# EAGLE design MBPH_MF_NGv1.2.2 (EAGLE 6.5.0)

## Sheet 1 of 2
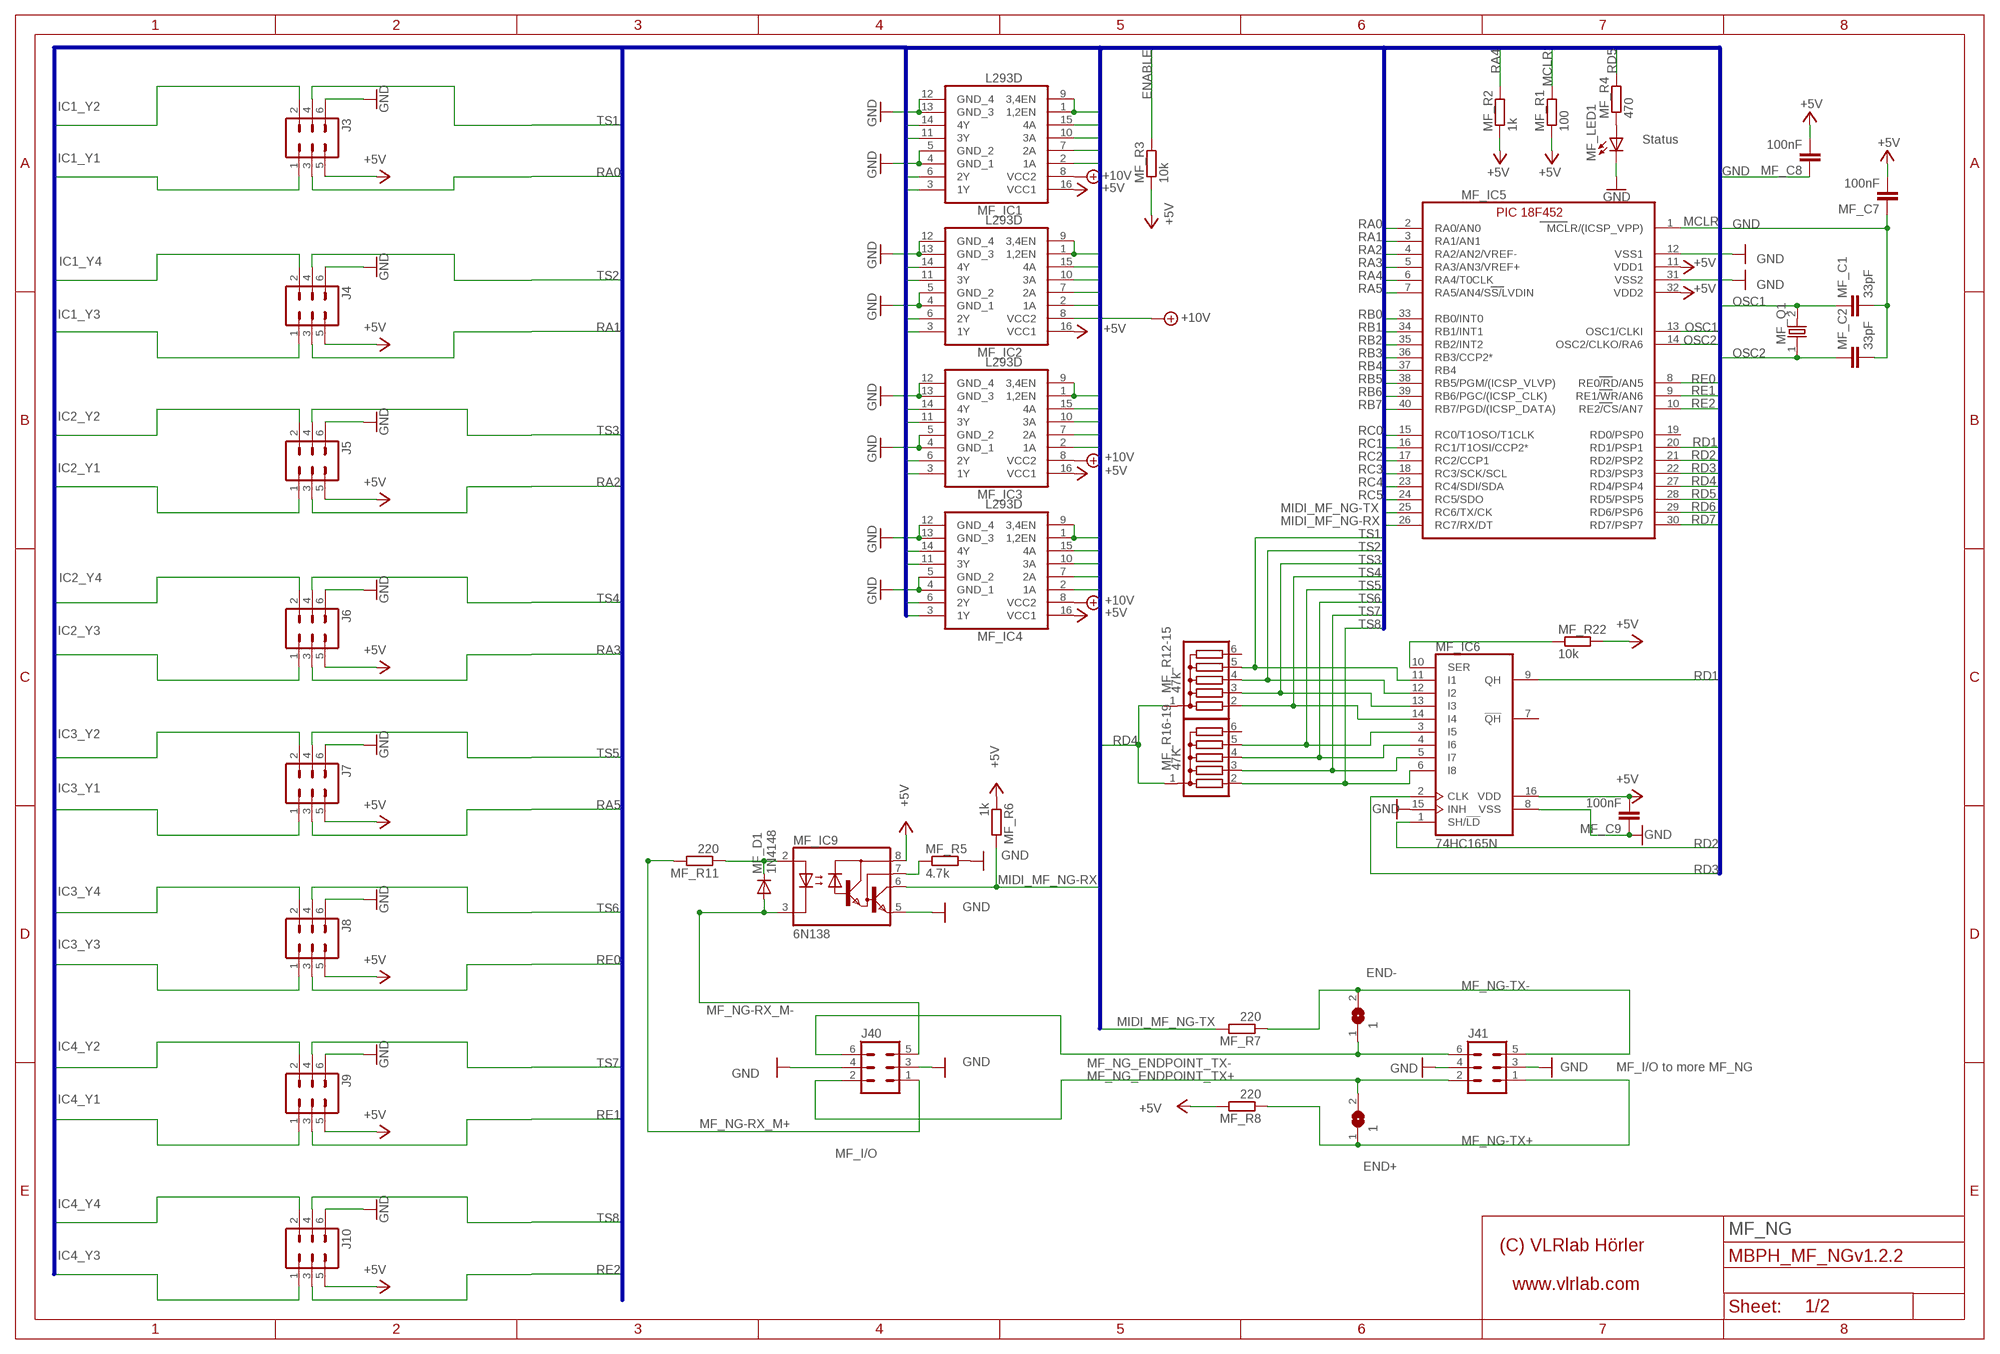
[diagram p0: schematic, sheet 1]

### Parts
END+  1  SJ  [SJ]
END-  1  SJ  [SJ]
J3  ML6  [ML6]
J4  ML6  [ML6]
J5  ML6  [ML6]
J6  ML6  [ML6]
J7  ML6  [ML6]
J8  ML6  [ML6]
J9  ML6  [ML6]
J10  ML6  [ML6]
J40  MF_I/O  ML6  [ML6]
J41  MF_I/O to more MF_NG  ML6  [ML6]
MF_C1  33pF  C-EU025-030X050  [C025-030X050]
MF_C2  33pF  C-EU025-030X050  [C025-030X050]
MF_C7  100nF  C5/3  [C5B3]
MF_C8  100nF  C5/3  [C5B3]
MF_C9  100nF  C5/3  [C5B3]
MF_D1  1N4148  1N4148DO35-7  [DO35-7]
MF_IC1  L293D  [DIL16]
MF_IC2  L293D  [DIL16]
MF_IC3  L293D  [DIL16]
MF_IC4  L293D  [DIL16]
MF_IC5  PIC18F452  PIC18F4X2DIL40  [DIL40]
MF_IC6  74HC165N  [DIL16]
MF_IC9  6N138  [DIL08]
MF_LED1  Status  LED3MM  [LED3MM]
MF_Q1  ECS-100-20-4X-DU  [HC-49/USX]
MF_R1  100  R-EU_0204/7  [0204/7]
MF_R2  1k  R-EU_0204/7  [0204/7]
MF_R3  10k  R-EU_0204/7  [0204/7]
MF_R4  470  R-EU_0204/7  [0204/7]
MF_R5  4.7k  R-EU_0204/7  [0204/7]
MF_R6  1k  R-EU_0204/7  [0204/7]
MF_R7  220  R-EU_0204/7  [0204/7]
MF_R8  220  R-EU_0204/7  [0204/7]
MF_R11  220  R-EU_0204/7  [0204/7]
MF_R12-15  47k  4306R  [SIL6]
MF_R16-19  47K  4306R  [SIL6]
MF_R22  10k  R-EU_0204/7  [0204/7]

### Nets
+5V [VDD]: J3.5 J4.5 J5.5 J6.5 J7.5 J8.5 J9.5 J10.5 MF_C7.2 MF_C8.2 MF_C9.2 MF_IC1.16(VCC1) MF_IC2.16(VCC1) MF_IC3.16(VCC1) MF_IC4.16(VCC1) MF_IC5.11(VDD1) MF_IC5.32(VDD2) MF_IC6.16(VDD) MF_IC9.8(VCC) MF_R1.1 MF_R2.1 MF_R3.1 MF_R6.1 MF_R8.2 MF_R22.2 ; also sheet 2
+10V [10V]: MF_IC1.8(VCC2) MF_IC2.8(VCC2) MF_IC3.8(VCC2) MF_IC4.8(VCC2) ; also sheet 2
ENABLE: MF_IC1.1(1,2EN) MF_IC1.9(3,4EN) MF_IC2.1(1,2EN) MF_IC2.9(3,4EN) MF_IC3.1(1,2EN) MF_IC3.9(3,4EN) MF_IC4.1(1,2EN) MF_IC4.9(3,4EN) MF_R3.2
GND: J3.6 J4.6 J5.6 J6.6 J7.6 J8.6 J9.6 J10.6 J40.3 J40.4 J41.3 J41.4 MF_C1.2 MF_C2.2 MF_C7.1 MF_C8.1 MF_C9.1 MF_IC1.4(GND_1) MF_IC1.5(GND_2) MF_IC1.12(GND_4) MF_IC1.13(GND_3) MF_IC2.4(GND_1) MF_IC2.5(GND_2) MF_IC2.12(GND_4) MF_IC2.13(GND_3) MF_IC3.4(GND_1) MF_IC3.5(GND_2) MF_IC3.12(GND_4) MF_IC3.13(GND_3) MF_IC4.4(GND_1) MF_IC4.5(GND_2) MF_IC4.12(GND_4) MF_IC4.13(GND_3) MF_IC5.12(VSS1) MF_IC5.31(VSS2) MF_IC6.8(VSS) MF_IC6.15(INH) MF_IC9.5(GND) MF_LED1.K(C) MF_R5.2 ; also sheet 2
IC1_Y1 [10V]: J3.1 MF_IC1.3(1Y)
IC1_Y2 [10V]: J3.2 MF_IC1.6(2Y)
IC1_Y3 [10V]: J4.1 MF_IC1.11(3Y)
IC1_Y4 [10V]: J4.2 MF_IC1.14(4Y)
IC2_Y1 [10V]: J5.1 MF_IC2.3(1Y)
IC2_Y2 [10V]: J5.2 MF_IC2.6(2Y)
IC2_Y3 [10V]: J6.1 MF_IC2.11(3Y)
IC2_Y4 [10V]: J6.2 MF_IC2.14(4Y)
IC3_Y1 [10V]: J7.1 MF_IC3.3(1Y)
IC3_Y2 [10V]: J7.2 MF_IC3.6(2Y)
IC3_Y3 [10V]: J8.1 MF_IC3.11(3Y)
IC3_Y4 [10V]: J8.2 MF_IC3.14(4Y)
IC4_Y1 [10V]: J9.1 MF_IC4.3(1Y)
IC4_Y2 [10V]: J9.2 MF_IC4.6(2Y)
IC4_Y3 [10V]: J10.1 MF_IC4.11(3Y)
IC4_Y4 [10V]: J10.2 MF_IC4.14(4Y)
MCLR: MF_IC5.1(MCLR/(ICSP_VPP)) MF_R1.2
MF_NG-RX_M+: J40.1 MF_R11.2
MF_NG-RX_M-: J40.5 MF_D1.A MF_IC9.3(C)
MF_NG-TX+: END+.1 J41.1 MF_R8.1
MF_NG-TX-: END-.2 J41.5 MF_R7.1
MF_NG_ENDPOINT_TX+: END+.2 J40.2 J41.2
MF_NG_ENDPOINT_TX-: END-.1 J40.6 J41.6
MIDI_MF_NG-RX: MF_IC5.26(RC7/RX/DT) MF_IC9.6(VO) MF_R6.2
MIDI_MF_NG-TX: MF_IC5.25(RC6/TX/CK) MF_R7.2
N$1: MF_IC6.10(SER) MF_R22.1
N$2: MF_LED1.A MF_R4.1
N$76: MF_IC9.7(VB) MF_R5.1
N$101: MF_D1.C MF_IC9.2(A) MF_R11.1
OSC1: MF_C1.1 MF_IC5.13(OSC1/CLKI) MF_Q1.2
OSC2: MF_C2.1 MF_IC5.14(OSC2/CLKO/RA6) MF_Q1.1
RA0: J3.3 MF_IC5.2(RA0/AN0)
RA1: J4.3 MF_IC5.3(RA1/AN1)
RA2: J5.3 MF_IC5.4(RA2/AN2/VREF-)
RA3: J6.3 MF_IC5.5(RA3/AN3/VREF+)
RA4: MF_IC5.6(RA4/T0CLK) MF_R2.2
RA5: J7.3 MF_IC5.7(RA5/AN4/SS/LVDIN)
RB0: MF_IC2.15(4A) MF_IC5.33(RB0/INT0)
RB1: MF_IC2.10(3A) MF_IC5.34(RB1/INT1)
RB2: MF_IC2.7(2A) MF_IC5.35(RB2/INT2)
RB3: MF_IC2.2(1A) MF_IC5.36(RB3/CCP2*)
RB4: MF_IC1.15(4A) MF_IC5.37(RB4)
RB5: MF_IC1.10(3A) MF_IC5.38(RB5/PGM/(ICSP_VLVP))
RB6: MF_IC1.7(2A) MF_IC5.39(RB6/PGC/(ICSP_CLK))
RB7: MF_IC1.2(1A) MF_IC5.40(RB7/PGD/(ICSP_DATA))
RC0: MF_IC4.15(4A) MF_IC5.15(RC0/T1OSO/T1CLK)
RC1: MF_IC4.10(3A) MF_IC5.16(RC1/T1OSI/CCP2*)
RC2: MF_IC4.7(2A) MF_IC5.17(RC2/CCP1)
RC3: MF_IC4.2(1A) MF_IC5.18(RC3/SCK/SCL)
RC4: MF_IC3.15(4A) MF_IC5.23(RC4/SDI/SDA)
RC5: MF_IC3.10(3A) MF_IC5.24(RC5/SDO)
RD1: MF_IC5.20(RD1/PSP1) MF_IC6.9(QH)
RD2: MF_IC5.21(RD2/PSP2) MF_IC6.1(SH/!LD)
RD3: MF_IC5.22(RD3/PSP3) MF_IC6.2(CLK)
RD4: MF_IC5.27(RD4/PSP4) MF_R12-15.1 MF_R16-19.1
RD5: MF_IC5.28(RD5/PSP5) MF_R4.2
RD6: MF_IC3.7(2A) MF_IC5.29(RD6/PSP6)
RD7: MF_IC3.2(1A) MF_IC5.30(RD7/PSP7)
RE0: J8.3 MF_IC5.8(RE0/RD/AN5)
RE1: J9.3 MF_IC5.9(RE1/WR/AN6)
RE2: J10.3 MF_IC5.10(RE2/CS/AN7)
TS1: J3.4 MF_IC6.11(I1) MF_R12-15.5
TS2: J4.4 MF_IC6.12(I2) MF_R12-15.4
TS3: J5.4 MF_IC6.13(I3) MF_R12-15.3
TS4: J6.4 MF_IC6.14(I4) MF_R12-15.2
TS5: J7.4 MF_IC6.3(I5) MF_R16-19.5
TS6: J8.4 MF_IC6.4(I6) MF_R16-19.4
TS7: J9.4 MF_IC6.5(I7) MF_R16-19.3
TS8: J10.4 MF_IC6.6(I8) MF_R16-19.2
Unconnected: MF_IC5.19(RD0/PSP0) MF_IC6.7(!QH) MF_R12-15.6 MF_R16-19.6

### Buses
ENABLE,IC1_Y[1..4],IC2_Y[1..4],IC3_Y[1..4],IC4_Y[1..4],MCLR,RA0,RA1,RA2,RA3,RA4,RA5,RE0,RE1,RE2,VDD_5V,VDD_M,GND,OSC1,OSC2,RC0,RC1,RC2,RC3,RD0,RD1,RD2,RD3,RC4,RC5,TX,RX,RD4,RD5,RD6,RD7,RB0,RB1,RB2,RB3,RB4,RB5,RB6,RB7,TS1,TS2,TS3,TS4,TS5,TS6,TS7,TS8,MIDI_MF_NG-TX,MIDI_MF_NG-RX

### Notes on the sheet
- MF_NG

## Sheet 2 of 2
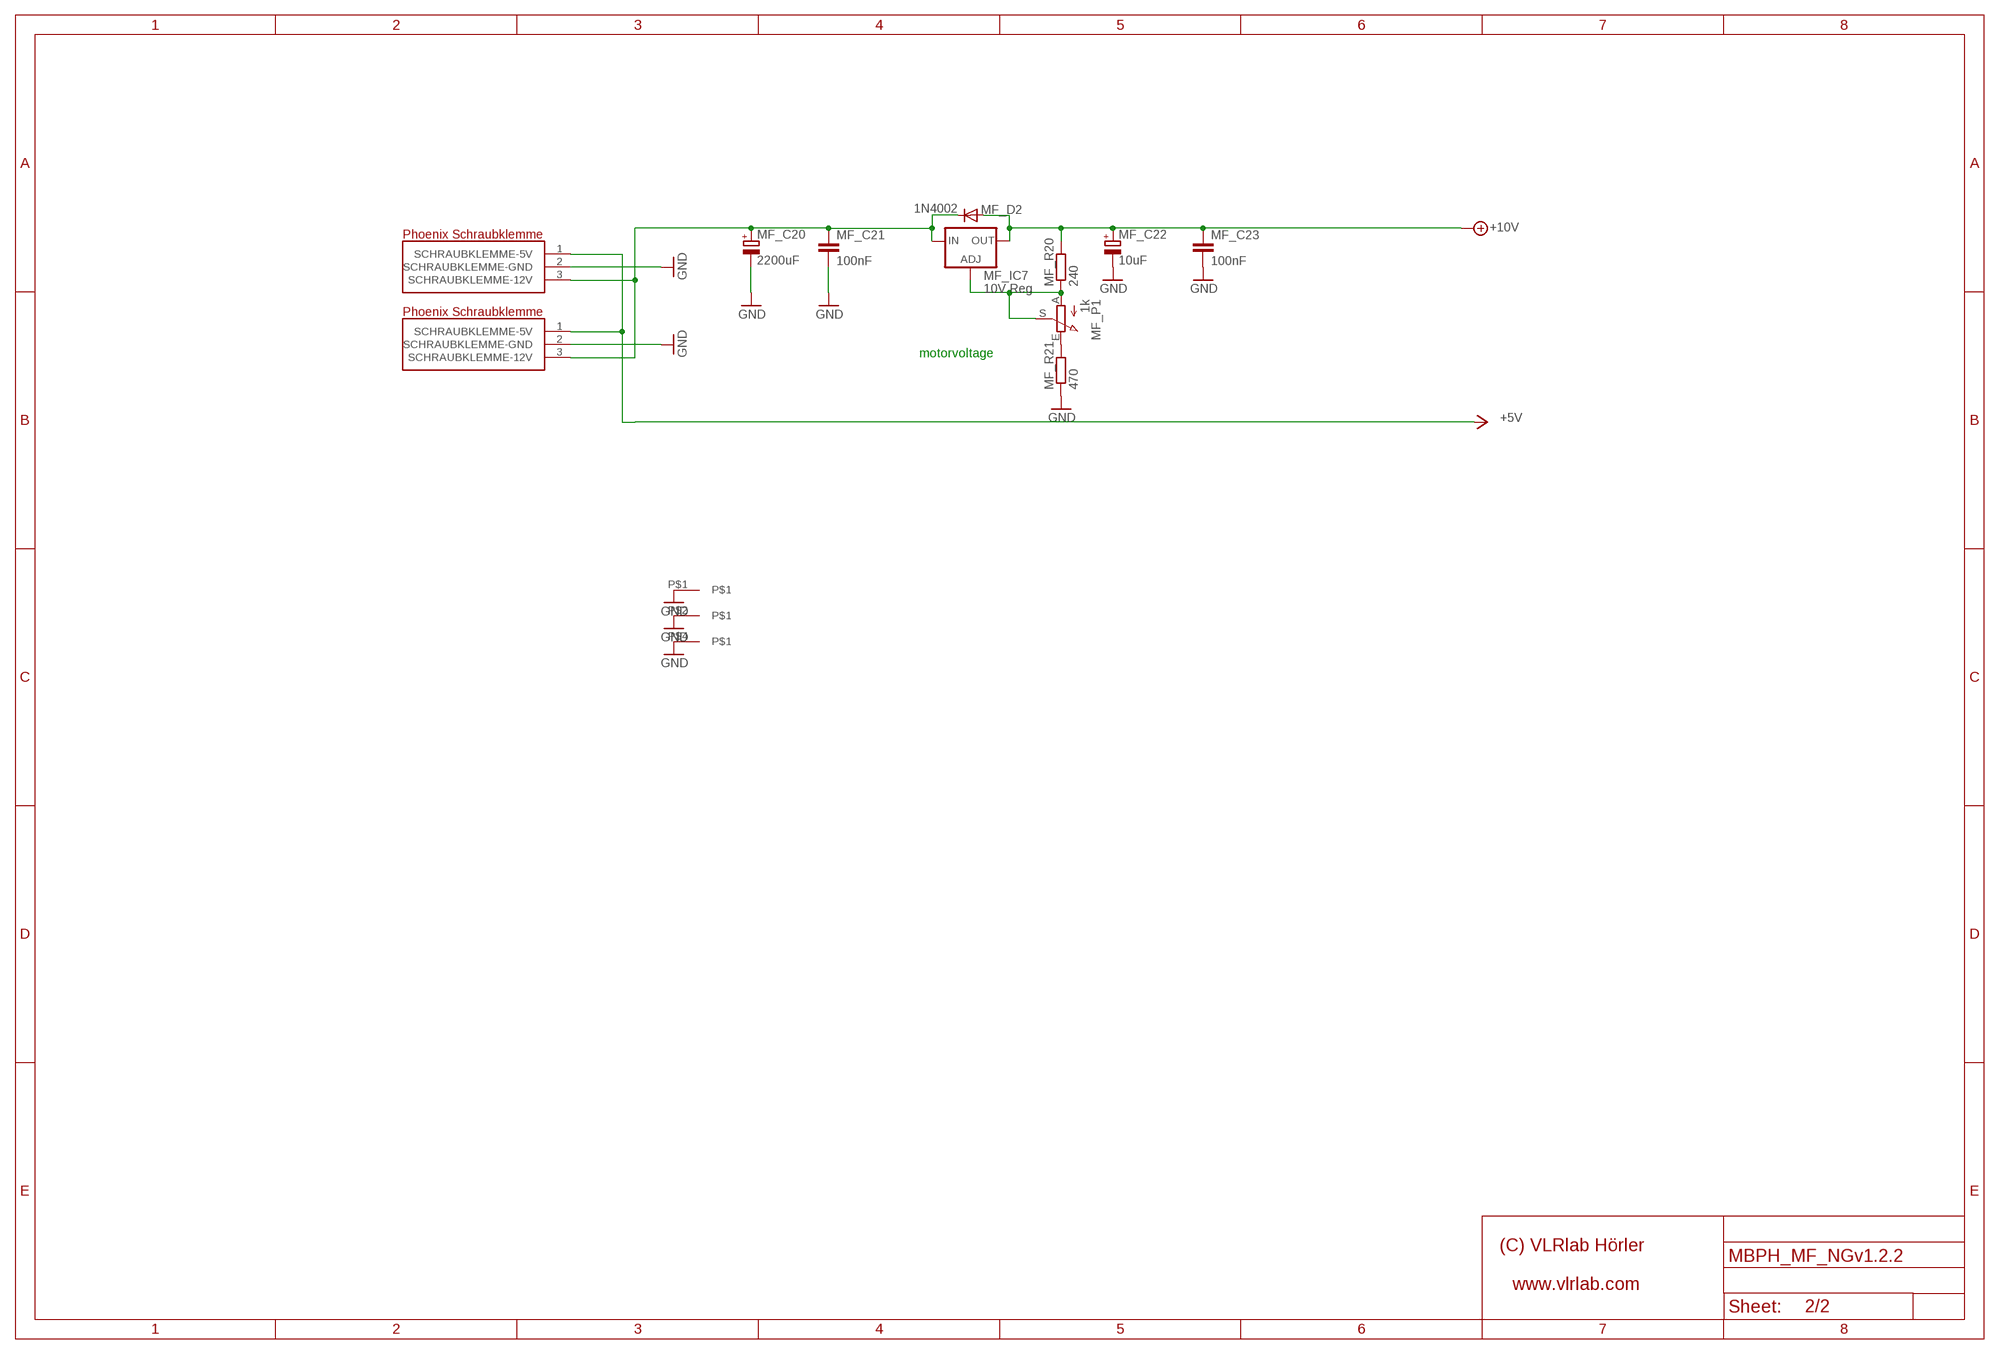
[diagram p1: schematic, sheet 2]

### Parts
KLEMME1  PT-1.5/3  [PT-1.5/3-5.0]
KLEMME2  PT-1.5/3  [PT-1.5/3-5.0]
MF_C20  2200uF  CPOL-EUE5-13  [E5-13]
MF_C21  100nF  C5/3  [C5B3]
MF_C22  10uF  CPOL-EUE2,5-6E  [E2,5-6E]
MF_C23  100nF  C5/3  [C5B3]
MF_D2  1N4002  [D040-10]
MF_IC7  10V Reg  LM317TS  [317TS]
MF_P1  1k  PHIER_6MM  [6MM_V]
MF_R20  240  R-EU_0204/7  [0204/7]
MF_R21  470  R-EU_0204/7  [0204/7]
U$3  MIDIBOX_HALF  [MIDIBOX14X6]

### Nets
+5V [VDD]: KLEMME1.1(SCHRAUBKLEMME-5V) KLEMME2.1(SCHRAUBKLEMME-5V) ; also sheet 1
+10V [10V]: MF_C22.+ MF_C23.1 MF_D2.A MF_IC7.2(OUT) MF_R20.2 ; also sheet 1
+12V [10V]: KLEMME1.3(SCHRAUBKLEMME-12V) KLEMME2.3(SCHRAUBKLEMME-12V) MF_C20.+ MF_C21.1 MF_D2.C MF_IC7.3(IN)
GND: KLEMME1.2(SCHRAUBKLEMME-GND) KLEMME2.2(SCHRAUBKLEMME-GND) MF_C20.- MF_C21.2 MF_C22.- MF_C23.2 MF_R21.1 U$3.P$1 U$3.P$2 U$3.P$4 ; also sheet 1
N$98: MF_IC7.1(ADJ) MF_P1.A MF_P1.S MF_R20.1
N$105: MF_P1.E MF_R21.2

### Notes on the sheet
- motorvoltage

## Library data of the parts
END+ END- = Jumper:SJ: SMD solder JUMPER
J3-J10 J40 J41 = con-ml:ML6: HARTING; OC_FARNELL: unknown; OC_NEWARK: unknown
KLEMME1 KLEMME2 = Phonenix Contacts:PT-1.5/3
MF_C1 MF_C2 = rcl:C-EU: CAPACITOR, European symbol
MF_C7-MF_C9 MF_C21 MF_C23 = capacitor-wima:C: CAPACITOR naming: grid - package width
MF_C20 = resistor:CPOL-EU: POLARIZED CAPACITOR, European symbol
MF_C22 = rcl:CPOL-EU: POLARIZED CAPACITOR, European symbol
MF_D1 = diode:1N4148: DIODE high speed (Philips)
MF_D2 = Diode 1N4002:1N4002
MF_IC1-MF_IC4 = L293:L293D
MF_IC5 = pic18f452:PIC18F4X2: Pic Microcontroller
MF_IC6 = 74-595:74HC165N
MF_IC7 = v-reg:LM317TS: VOLTAGE REGULATOR
MF_IC9 = optocoupler:6N138: MOTOROLA OPTO COUPLER; MF: VISHAY/TELEFUNKEN; MPN: 6N138; OC_FARNELL: 9860150; OC_NEWARK: 35K5294
MF_LED1 = led:LED: LED OSRAM: - CHIPLED LG R971, LG N971, LY N971, LG Q971, LY Q971, LO R971, LY R971 LH N974, LH R974 LS Q976, LO Q976, LY Q976 LO Q996 - Hyper CHIPLED LW Q18S LB Q993, LB Q99A, LB R99A - SideLED LS A670, LO A670, LY A670, LG A670, LP A670 LB A673, LV A673, LT A673, LW A673 LH A674 LY A675 LS A676, LA A676, LO A676, LY A676, LW A676 LS A679, LY A679, LG A679 - Hyper Micro SIDELED® LS Y876, LA Y876, LO Y876, LY Y876 LT Y87S - SmartLED LW L88C, LW L88S LB L89C, LB L89S, LG L890 LS L89K, LO L89K, LY L89K LS L896, LA L896, LO L896, LY L896 - TOPLED LS T670, LO T670, LY T670, LG T670, LP T670 LSG T670, LSP T670, LSY T670, LOP T670, LYG T670 LG T671, LOG T671, LSG T671 LB T673, LV T673, LT T673, LW T673 LH T674 LS T676, LA T676, LO T676, LY T676, LB T676, LH T676, LSB T676, LW T676 LB T67C, LV T67C, LT T67C, LS T67K, LO T67K, LY T67K, LW E67C LS E67B, LA E67B, LO E67B, LY E67B, LB E67C, LV E67C, LT E67C LW T67C LS T679, LY T679, LG T679 LS T770, LO T770, LY T770, LG T770, LP T770 LB T773, LV T773, LT T773, LW T773 LH T774 LS E675, LA E675, LY E675, LS T675 LS T776, LA T776, LO T776, LY T776, LB T776 LHGB T686 LT T68C, LB T68C - Hyper Mini TOPLED® LB M676 - Mini TOPLED Santana® LG M470 LS M47K, LO M47K, LY M47K Source: http://www.osram.convergy.de LUXEON: - LUMILED® LXK2-PW12-R00, LXK2-PW12-S00, LXK2-PW14-U00, LXK2-PW14-V00 LXK2-PM12-R00, LXK2-PM12-S00, LXK2-PM14-U00 LXK2-PE12-Q00, LXK2-PE12-R00, LXK2-PE12-S00, LXK2-PE14-T00, LXK2-PE14-U00 LXK2-PB12-K00, LXK2-PB12-L00, LXK2-PB12-M00, LXK2-PB14-N00, LXK2-PB14-P00, LXK2-PB14-Q00 LXK2-PR12-L00, LXK2-PR12-M00, LXK2-PR14-Q00, LXK2-PR14-R00 LXK2-PD12-Q00, LXK2-PD12-R00, LXK2-PD12-S00 LXK2-PH12-R00, LXK2-PH12-S00 LXK2-PL12-P00, LXK2-PL12-Q00, LXK2-PL12-R00 Source: www.luxeon.com KINGBRIGHT: KA-3528ASYC Source: www.kingbright.com
MF_P1 = Potentiometer 6mm:PHIER_6MM
MF_Q1 = Cristal_10MHz:ECS-100-20-4X-DU
MF_R1-MF_R8 MF_R11 MF_R22 = resistor:R-EU_: RESISTOR, European symbol
MF_R12-15 MF_R16-19 = Bourns Resistor Array:4306R
MF_R20 MF_R21 = rcl:R-EU_: RESISTOR, European symbol
U$3 = Frames_VLR:MIDIBOX_HALF

## Net classes
0 default: width 0.254 mm, drill 0.33 mm, clearance 0.203 mm
1 VDD: width 0.813 mm, drill 0.33 mm, clearance 0.203 mm to class 0, clearance 0.203 mm
2 10V: width 1.016 mm, drill 0.33 mm, clearance 0.254 mm to class 0, clearance 0.203 mm to class 1, clearance 0.203 mm

## Board
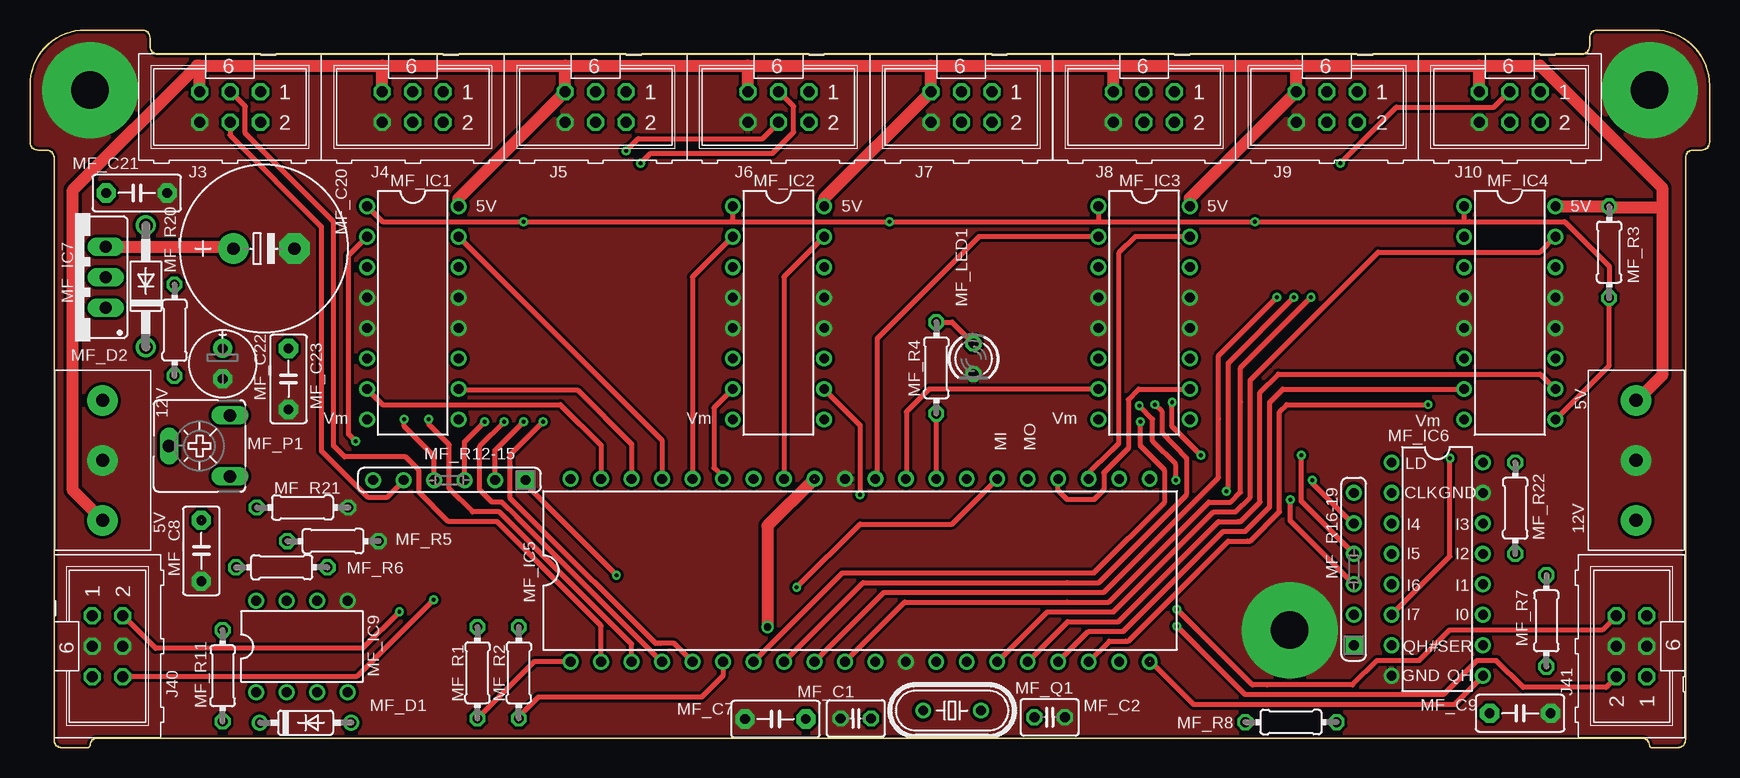
[diagram p2: board, top side]
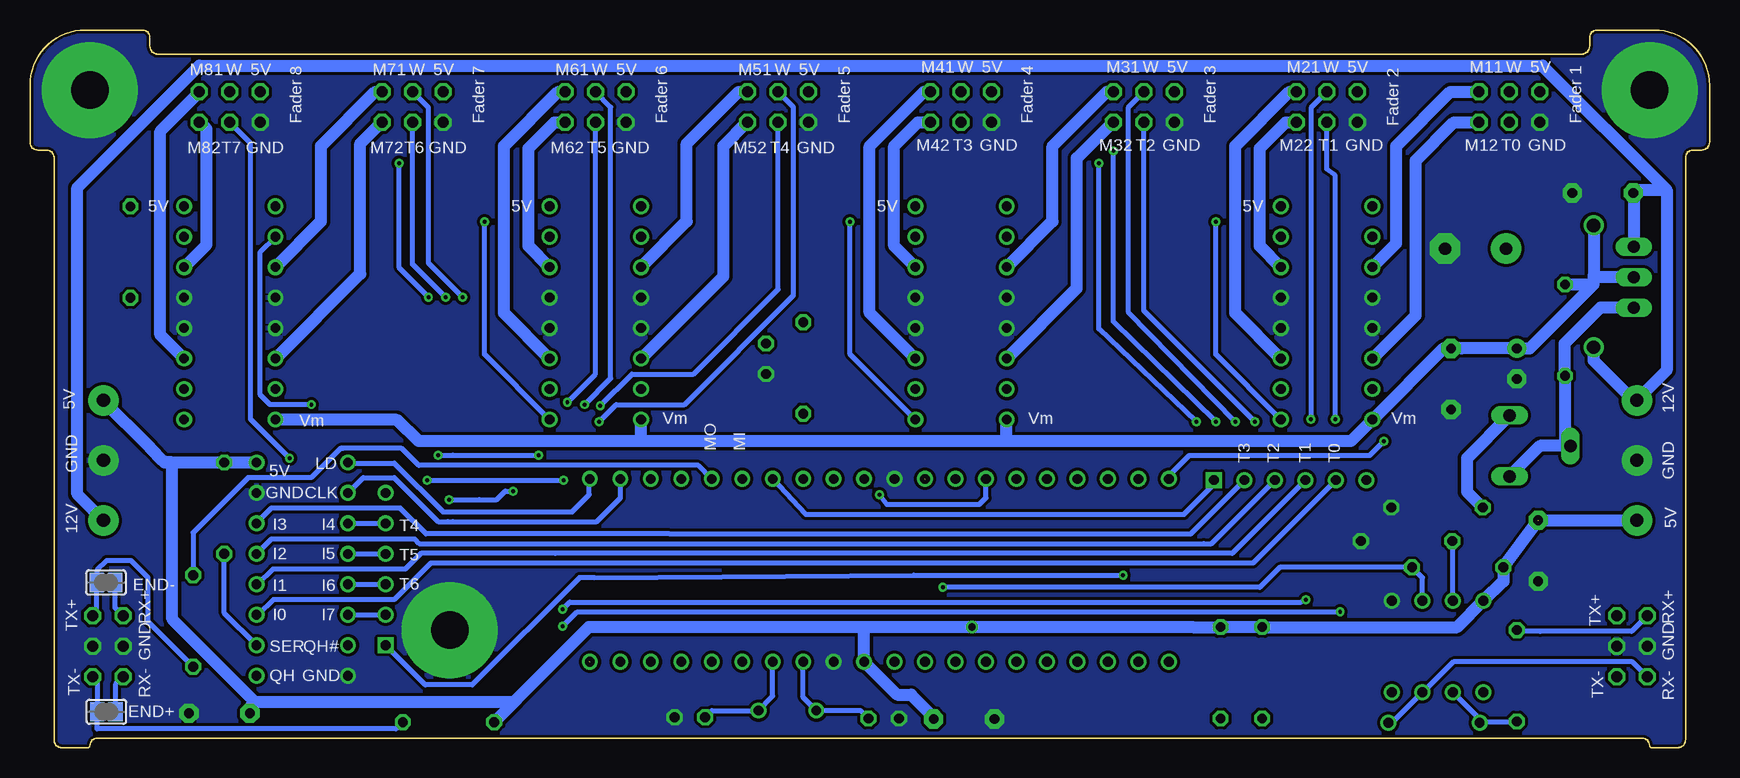
[diagram p3: board, bottom side, seen from below]

Size 140 x 59.8 mm. Coordinates in mm from the lower left corner, seen from the top.
Copper layers (1*16): Top 0.035mm / dielectric 1.5mm / Bottom 0.035mm
Design rules "makePCB *": minimum track width 16mil, minimum drill 13mil, track to track 10mil, track to pad 10mil, pad to pad 10mil, via to via 10mil, smd to smd 8mil, copper to edge 8mil, drill to drill 8mil, minimum pad ring 10mil, minimum via ring 8mil, stop-mask expansion 2mil, vias tented up to drill 0mil, thermal gap 0mil

### Footprints (pad centres in the part's own frame; a part is rotated, then mirrored left to right if it is on the bottom)
SJ = smd 1.168 x 1.6: 1 -0.762,0; 2 0.762,0
ML6 = drill 0.914 octagon: 1 -2.54,-1.27; 2 -2.54,1.27; 3 0,-1.27; 4 0,1.27; 5 2.54,-1.27; 6 2.54,1.27
PT-1.5/3-5.0 = drill 1.1 pad 2.54: 1 5,0; 2 0,0; 3 -5,0
C025-030X050 = drill 0.813 octagon: 1 -1.27,0; 2 1.27,0
C5B3 = drill 0.813 pad 1.6 octagon: 1 -2.54,0; 2 2.54,0
E5-13 = drill 1.016 pad 2.54: + -2.54,0 | drill 1.016 pad 2.54 octagon: - 2.54,0
E2,5-6E = drill 0.813 pad 1.575: + -1.27,0 | drill 0.813 pad 1.575 octagon: - 1.27,0
DO35-7 = drill 0.813: A 3.81,0; C -3.81,0
D040-10 = drill 1.118: A 5.08,0; C -5.08,0
DIL16 = drill 0.813: 1 -7.62,-3.81; 2 -5.08,-3.81; 3 -2.54,-3.81; 4 0,-3.81; 5 2.54,-3.81; 6 5.08,-3.81; 7 7.62,-3.81; 8 10.16,-3.81; 9 10.16,3.81; 10 7.62,3.81; 11 5.08,3.81; 12 2.54,3.81; 13 0,3.81; 14 -2.54,3.81; 15 -5.08,3.81; 16 -7.62,3.81
DIL40 = drill 0.813: 1 -24.13,-7.62; 2 -21.59,-7.62; 3 -19.05,-7.62; 4 -16.51,-7.62; 5 -13.97,-7.62; 6 -11.43,-7.62; 7 -8.89,-7.62; 8 -6.35,-7.62; 9 -3.81,-7.62; 10 -1.27,-7.62; 11 1.27,-7.62; 12 3.81,-7.62; 13 6.35,-7.62; 14 8.89,-7.62; 15 11.43,-7.62; 16 13.97,-7.62; 17 16.51,-7.62; 18 19.05,-7.62; 19 21.59,-7.62; 20 24.13,-7.62; 21 24.13,7.62; 22 21.59,7.62; 23 19.05,7.62; 24 16.51,7.62; 25 13.97,7.62; 26 11.43,7.62; 27 8.89,7.62; 28 6.35,7.62; 29 3.81,7.62; 30 1.27,7.62; 31 -1.27,7.62; 32 -3.81,7.62; 33 -6.35,7.62; 34 -8.89,7.62; 35 -11.43,7.62; 36 -13.97,7.62; 37 -16.51,7.62; 38 -19.05,7.62; 39 -21.59,7.62; 40 -24.13,7.62
DIL16' = drill 0.813: 1 -8.89,-3.81; 2 -6.35,-3.81; 3 -3.81,-3.81; 4 -1.27,-3.81; 5 1.27,-3.81; 6 3.81,-3.81; 7 6.35,-3.81; 8 8.89,-3.81; 9 8.89,3.81; 10 6.35,3.81; 11 3.81,3.81; 12 1.27,3.81; 13 -1.27,3.81; 14 -3.81,3.81; 15 -6.35,3.81; 16 -8.89,3.81
317TS = drill 1.016 long: 1 -2.54,-2.54; 2 0,-2.54; 3 2.54,-2.54
DIL08 = drill 0.813: 1 -3.81,-3.81; 2 -1.27,-3.81; 3 1.27,-3.81; 4 3.81,-3.81; 5 3.81,3.81; 6 1.27,3.81; 7 -1.27,3.81; 8 -3.81,3.81
LED3MM = drill 0.813 octagon: A -1.27,0; K 1.27,0
6MM_V = drill 1.016 long: A -2.54,-2.54; E 2.54,-2.54; S 0,2.54
HC-49/USX = drill 0.813: 1 -2.413,0; 2 2.413,0
0204/7 = drill 0.813 octagon: 1 -3.81,0; 2 3.81,0
SIL6 = drill 0.813 square: 1 -6.35,0 | drill 0.813: 2 -3.81,0; 3 -1.27,0; 4 1.27,0; 5 3.81,0; 6 6.35,0
MIDIBOX14X6 = drill 3.1 pad 8: P$1 5,135; P$2 50,105; P$4 5,5

### Placement (x,y rotation side)
END+  133.64,2.99 0 bottom
END-  133.66,13.76 180 bottom
J3  16.67,53.38 180 top
J4  31.91,53.38 180 top
J5  47.15,53.38 180 top
J6  62.39,53.38 180 top
J7  77.63,53.38 180 top
J8  92.87,53.38 180 top
J9  108.11,53.38 180 top
J10  123.35,53.38 180 top
J40  6.46,8.45 270 top
J41  133.51,8.45 90 top
KLEMME1  6.05,23.94 270 top
KLEMME2  133.88,23.94 90 top
MF_C1  68.84,2.43 180 top
MF_C2  85,2.53 0 top
MF_C7  62.14,2.38 0 top
MF_C8  14.28,16.4 90 top
MF_C9  124.21,2.86 180 top
MF_C20  19.5,41.58 0 top
MF_C21  8.9,46.22 0 top
MF_C22  16.06,31.99 270 top
MF_C23  21.55,30.72 270 top
MF_D1  22.97,2.07 0 top
MF_D2  9.66,38.44 90 top
MF_IC1  31.91,37.5 270 top
MF_IC2  62.39,37.5 270 top
MF_IC3  92.87,37.5 270 top
MF_IC4  123.35,37.5 270 top
MF_IC5  69.2,14.77 0 top
MF_IC6  74HC165N  [DIL16']  117.3,14.87 270 top
MF_IC7  3.77,39.21 90 top
MF_IC9  22.66,8.42 0 top
MF_LED1  78.65,32.4 270 top
MF_P1  14.13,25.14 90 top
MF_Q1  76.87,3.09 180 top
MF_R1  37.29,6.24 270 top
MF_R2  40.75,6.24 270 top
MF_R3  131.63,41.29 270 top
MF_R4  75.55,31.64 270 top
MF_R5  25.26,17.21 0 top
MF_R6  20.99,15.03 0 top
MF_R7  126.4,10.56 90 top
MF_R8  105.11,2.12 180 top
MF_R11  16.06,5.98 90 top
MF_R12-15  34.96,22.29 180 top
MF_R16-19  110.35,14.87 90 top
MF_R20  12.05,34.79 90 top
MF_R21  22.72,20 180 top
MF_R22  123.81,19.95 90 top
U$3  0,59.8 270 top

### Tracks (layer width: path | path; a pad name or v marks a point on that pad's centre or on a via)
+5V  (via drill 0.6)  (2 unrouted)
  Top 1.016: KLEMME1.1 3.56,21.43 3.56,46.47 13.93,56.83 14.13,56.83 | 14.13,56.83 29.37,56.83 | 29.37,56.83 44.61,56.83 | 44.61,56.83 59.85,56.83 | 59.85,56.83 75.09,56.83 | 75.09,56.83 90.33,56.83 | 90.33,56.83 105.57,56.83 | 105.57,56.83 120.81,56.83 | 120.81,56.83 125.89,56.83 136.05,46.67 136.05,45.05 | 136.05,45.05 136.05,31.03 133.96,28.94 KLEMME2.1 | J10.5 120.81,56.83 | 105.57,56.83 J9.5 96.68,45.76 MF_IC3.16 | MF_IC4.16 127.18,45.1 MF_R3.1 131.68,45.05 136.05,45.05 | 75.09,56.83 J7.5 66.2,45.76 MF_IC2.16 | J6.5 59.85,56.83 | 44.61,56.83 J5.5 35.72,45.76 MF_IC1.16 | J4.5 29.37,56.83 | J3.5 14.13,56.83 | 65.34,22.34 61.48,18.48 v61.48,10.05 | J8.5 90.33,56.83 | v61.48,10.05
  Bottom 1.016: 121.22,3.8 99.68,3.8 99.47,4 | 134.02,29 129.95,24.93 128.94,23.92 128.79,23.76 128.12,23.76 | 14.33,18.94 KLEMME1.1 | 121.22,3.8 128.12,10.71 128.12,23.76 | 128.12,23.76 MF_R22.2 MF_IC6.16 | 70.42,10.05 v61.48,10.05 43.08,10.05 MF_R2.1 MF_R1.1 21.04,10.05 MF_IC9.8 17.18,13.86 MF_R6.1 MF_C8.2 | 70.42,10.05 93.43,10.05 99.47,4 | 70.42,10.05 70.47,10 MF_IC5.11 67.72,4.41 66.56,4.41 64.68,2.53 MF_C7.2 | 121.22,3.8 121.67,3.34 MF_C9.2 | MF_R8.2 99.47,3.95 99.47,4
+10V
  Bottom 1.016: MF_IC7.2 9.66,39.21 | 9.66,39.21 9.66,39.36 MF_D2.A | MF_R20.2 9.66,38.6 | 9.66,38.6 9.66,39.21 | 9.66,38.6 14.99,33.26 MF_C22.+ 20.68,33.26 MF_C23.1 22.18,33.26 MF_IC1.8 29.9,25.54 58.63,25.54 | 58.63,25.54 89.11,25.54 | 89.11,25.54 107.6,25.54 109.43,27.32 119.54,27.32 MF_IC4.8 | MF_IC3.8 89.11,27.29 89.11,25.54 | MF_IC2.8 58.63,27.29 58.63,25.54
+12V
  Top 1.016: MF_IC7.3 16.8,41.75 MF_C20.+
  Bottom 1.016: KLEMME2.3 136.05,21.11 136.05,46.67 125.89,56.83 13.93,56.83 3.56,46.47 | 3.56,46.47 3.56,31.43 KLEMME1.3 | KLEMME1.3 | 3.56,46.47 6.1,46.47 MF_C21.1 6.31,45.86 MF_IC7.3 | KLEMME1.3 6.36,28.95 9.66,32.25 MF_D2.C
ENABLE  (via drill 0.33)
  Top 0.406: MF_IC1.1 29.39,43.83 v41.16,43.83 58.43,43.83 | 58.43,43.83 v71.64,43.83 89.11,43.83 | 89.11,43.83 v102.12,43.83 120,43.83 | 120,43.83 127.92,43.83 131.63,40.12 MF_R3.2 131.63,31.81 MF_IC4.9 | MF_IC4.1 119.54,43.83 120,43.83 | MF_IC3.1 89.06,43.83 89.11,43.83 | MF_IC2.1 58.58,43.83 58.43,43.83
  Bottom 0.406: MF_IC1.9 41.16,32.78 v41.16,43.83 | MF_IC2.9 71.64,32.78 v71.64,43.83 | MF_IC3.9 102.12,32.78 v102.12,43.83
GND
  pour Bottom: -0.35,59.96 140.07,59.86 140.27,0 -0.55,0
  pour Top: -0.35,59.96 140.07,59.86 140.27,0 -0.55,0
IC1_Y1
  Bottom 1.016: MF_IC1.3 26.12,42.02 26.12,50.13 21.6,54.65 J3.1
IC1_Y2
  Bottom 1.016: MF_IC1.6 24.49,36.03 24.49,48.91 21.29,52.11 J3.2
IC1_Y3
  Bottom 1.016: MF_IC1.11 39.53,36.23 39.53,50.13 35.01,54.65 J4.1
IC1_Y4
  Bottom 1.016: MF_IC1.14 37.5,41.82 37.5,49.93 35.31,52.11 J4.2
IC2_Y1
  Bottom 1.016: MF_IC2.3 54.77,43.85 54.77,50.13 50.25,54.65 J5.1
IC2_Y2
  Bottom 1.016: MF_IC2.6 52.74,38.26 52.74,49.11 49.74,52.11 J5.2
IC2_Y3
  Bottom 1.016: MF_IC2.11 70.01,36.23 70.01,50.13 65.49,54.65 J6.1
IC2_Y4
  Bottom 1.016: MF_IC2.14 67.98,41.82 67.98,50.13 66,52.11 J6.2
IC3_Y1
  Bottom 1.016: MF_IC3.3 85.25,43.85 85.25,50.33 80.93,54.65 J7.1
IC3_Y2
  Bottom 1.016: MF_IC3.6 82.2,39.28 82.2,50.13 80.22,52.11 J7.2
IC3_Y3
  Bottom 1.016: MF_IC3.11 100.49,36.23 100.49,50.13 95.97,54.65 J8.1
IC3_Y4
  Bottom 1.016: MF_IC3.14 98.46,41.82 98.46,49.93 96.27,52.11 J8.2
IC4_Y1
  Bottom 1.016: MF_IC4.3 115.73,43.85 115.73,48.91 115.73,50.13 111.21,54.65 J9.1
IC4_Y2
  Bottom 1.016: MF_IC4.6 112.48,39.48 112.48,50.33 110.7,52.11 J9.2
IC4_Y3
  Bottom 1.016: MF_IC4.11 129.14,34.4 129.14,51.35 125.89,54.6 J10.1
IC4_Y4
  Bottom 1.016: MF_IC4.14 125.28,41.92 125.28,51.55 125.84,52.11 J10.2
MCLR
  Top 0.406: MF_IC5.1 42.02,7.15 MF_R1.2
MF_NG-RX_M+
  Bottom 0.406: J40.1 6.49,9.69 14.13,9.69 15.55,9.69 MF_R11.2
MF_NG-RX_M-
  Bottom 0.406: MF_D1.A 26.47,2.07 MF_IC9.3 23.88,4.61 21.34,7.15 6.43,7.15 J40.5
MF_NG-TX+
  Bottom 0.406: J41.1 134.4,5.53 END+.1 134.4,1.59 134.42,1.56 109.48,1.56 MF_R8.1
MF_NG-TX-
  Bottom 0.406: MF_R7.1 130.16,10.51 130.16,14.16 131.58,15.59 133.61,15.59 134.42,14.77 END-.2 134.42,11.34 J41.5
MF_NG_ENDPOINT_TX+  (via drill 0.33)
  Top 0.406: J41.2 132.24,5.88 131.38,5.02 124.47,5.02 122.23,7.25 120.61,7.25 117.81,4.41 113.9,4.41 101.3,4.41 v95.61,10.1 | v30.79,11.32 27.74,8.27 10.47,8.27 7.76,10.99 J40.2
  Bottom 0.406: J41.2 132.88,5.27 END+.2 | v95.61,10.1 94.39,11.32 v30.79,11.32
MF_NG_ENDPOINT_TX-  (via drill 0.33)
  Top 0.406: J41.6 131.05,9.79 118.32,9.79 115.78,7.25 112.28,7.25 110.24,5.22 103.13,5.22 101.91,5.22 96.22,10.91 v95.61,11.52 | v33.64,12.33 27.21,5.91 J40.6
  Bottom 0.406: J41.6 132.9,11.65 END-.1 | v95.61,11.52 95,12.13 34.04,12.13 v33.64,12.33
MIDI_MF_NG-RX  (via drill 0.33)
  Top 0.406: v63.91,13.35 69.2,18.63 76.87,18.63 MF_IC5.26
  Bottom 0.406: MF_IC9.6 23.93,14.16 MF_R6.2 35.82,15.03 37.5,13.35 v63.91,13.35
MIDI_MF_NG-TX
  Bottom 0.406: MF_IC5.25 84.28,23.51 107.6,23.51 109.02,24.93 113.9,24.93 114.1,24.93 116.54,22.49 121.83,22.49 126.4,17.92 MF_R7.2
N$1
  Bottom 0.406: MF_IC6.10 123.81,11.22 MF_R22.1
N$2
  Top 0.406: MF_R4.1 76.87,35.45 MF_LED1.A
N$76
  Bottom 0.406: MF_IC9.7 21.39,17.16 MF_R5.1
N$98
  Bottom 1.016: MF_IC7.1 9.1,36.67 12.1,33.67 12.1,31.03 MF_R20.1 12.05,25.59 MF_P1.S 14.13,25.14 MF_P1.A
N$101
  Bottom 0.406: MF_IC9.2 19.16,2.38 MF_D1.C 19.06,2.17 MF_R11.1
N$105
  Bottom 1.016: MF_P1.E 20.23,24.12 20.23,21.88 20.23,21.32 MF_R21.2
OSC1
  Bottom 0.406: MF_C1.1 70.77,3.09 MF_Q1.2 75.55,4.18 MF_IC5.13
OSC2
  Bottom 0.406: MF_IC5.14 78.09,4.28 MF_Q1.1 83.17,3.09 MF_C2.1
RA0
  Top 0.406: MF_IC5.2 47.61,10.15 38.92,18.84 34.86,18.84 32.42,21.27 32.42,23.1 31.3,24.22 26.22,24.22 25.31,25.14 25.31,43.83 17.94,51.2 17.94,53.43 16.72,54.65 J3.3
RA1  (via drill 0.33)
  Top 0.406: MF_IC5.3 50.15,8.62 39.33,19.45 39.12,19.65 36.89,19.65 34.96,21.58 34.96,25.24 33.23,26.96 v33.23,27.37
  Bottom 0.406: v33.23,27.37 33.18,27.42 33.18,53.38 J4.3
RA2  (via drill 0.33)
  Top 0.406: MF_IC5.4 52.64,7.15 40.55,19.24 39.33,20.46 38.51,20.46 37.5,21.48 37.5,25.14 v39.53,27.17
  Bottom 0.406: v39.53,27.17 48.42,36.26 48.42,53.38 J5.3
RA3  (via drill 0.33)
  Top 0.406: MF_IC5.5 53.7,8.68 52.53,8.68 52.33,8.68 52.13,8.68 41.77,19.04 40.14,20.66 40.04,20.77 40.04,23.41 40.04,24.42 v42.78,27.17 | v50.91,48.71 51.72,49.52 61.88,49.52 63.66,51.3 63.66,53.43 62.44,54.65 J6.3
  Bottom 0.406: v42.78,27.17 50.91,34.89 v50.91,48.71
RA4
  Top 0.406: MF_IC5.6 57.77,5.98 55.99,4.21 42.38,4.21 40.75,2.58 MF_R2.2
RA5  (via drill 0.33)
  Top 0.406: MF_IC5.7 67.72,14.57 86.47,14.57 88.7,14.57 94.6,20.46 94.6,23.1 92.56,25.14 v92.56,27.17
  Bottom 0.406: v92.56,27.17 91.14,28.59 85.45,28.59 76.36,37.68 76.36,53.38 J7.3
RB0
  Top 0.406: MF_IC2.15 62.85,39.23 MF_IC5.33
RB1  (via drill 0.33)
  Top 0.406: MF_IC2.10 69.2,26.88 v69.2,21.07
  Bottom 0.406: v69.2,21.07 68.59,20.26 60.87,20.26 60.31,20.82 MF_IC5.34
RB2
  Top 0.406: MF_IC2.7 57,28.3 57,23.31 57.77,22.54 MF_IC5.35
RB3
  Top 0.406: MF_IC2.2 55.23,39.23 MF_IC5.36
RB4
  Top 0.406: MF_IC1.15 52.69,25.61 MF_IC5.37
RB5
  Top 0.406: MF_IC1.10 35.79,29.81 45.63,29.81 50.15,25.29 MF_IC5.38
RB6
  Top 0.406: MF_IC1.7 29.39,28.59 44.2,28.59 47.61,25.19 MF_IC5.39
RB7  (via drill 0.33)
  Top 0.406: MF_IC1.2 26.53,41.01 26.53,26.15 v27.14,25.54
  Bottom 0.406: v27.14,25.54 28.35,24.32 43.39,24.32 45.07,22.65 MF_IC5.40
RC0
  Top 0.406: MF_IC5.15 84.79,11.32 90.33,11.32 98.66,19.65 100.29,19.65 100.49,19.65 101.71,20.87 101.71,30.62 112.38,41.29 125.89,41.29 127.16,42.56 MF_IC4.15
RC1
  Top 0.406: MF_IC5.16 86.52,10.51 90.74,10.51 99.07,18.84 100.69,18.84 100.9,18.84 102.52,20.46 102.52,29.61 104.05,31.13 125.89,31.13 127.14,29.88 MF_IC4.10
RC2
  Top 0.406: MF_IC5.17 88.25,9.69 91.14,9.69 99.47,18.02 101.1,18.02 101.3,18.02 103.33,20.05 103.33,28.79 104.42,29.88 MF_IC4.7
RC3  (via drill 0.33)
  Top 0.406: MF_IC5.18 89.97,8.88 91.35,8.88 91.55,8.88 99.88,17.21 101.51,17.21 101.71,17.21 104.15,19.65 104.15,27.98 104.76,28.59 v116.54,28.59
  Bottom 0.406: v116.54,28.59 120,28.59 120.81,29.4 120.81,41.31 MF_IC4.2
RC4
  Top 0.406: MF_IC3.15 92.13,42.58 90.74,41.19 90.74,25.34 90.13,24.73 88.25,22.85 MF_IC5.23
RC5
  Top 0.406: MF_IC5.24 85.71,21.43 86.47,20.66 86.67,20.66 87.08,20.66 88.7,20.66 89.52,21.48 89.52,22.92 89.54,22.92 91.55,24.93 91.55,29 92.36,29.81 92.43,29.88 MF_IC3.10
RD1  (1 unrouted)
  Top 0.406: 93.38,7.2 96.98,3.6 118.78,3.6 121.11,5.93 MF_IC6.9
RD2
  Bottom 0.406: MF_IC6.1 113.44,23.71 109.63,23.71 105.57,19.65 103.33,19.65 94.8,19.65 93.38,21.07 93.38,22.34 MF_IC5.21
RD3
  Bottom 0.406: MF_IC6.2 112.22,22.49 109.63,22.49 105.98,18.84 105.16,18.84 104.76,18.84 92.77,18.84 90.79,20.82 MF_IC5.22
RD4  (via drill 0.33)
  Top 0.406: v48.88,14.37 41.31,21.93 MF_R12-15.1
  Bottom 0.406: v48.88,14.37 66.35,14.37 92.97,14.16 94.19,14.16 103.13,5.22 107.04,5.22 MF_R16-19.1 | MF_IC5.27 75.34,19.45 75.29,19.45 43.8,19.45 41.31,21.93 MF_R12-15.1
RD5
  Top 0.406: MF_IC5.28 MF_R4.2
RD6
  Top 0.406: MF_IC3.7 74.96,29.88 73.06,27.98 73.06,22.44 MF_IC5.29
RD7
  Top 0.406: MF_IC3.2 79.12,42.58 70.62,34.08 70.62,22.54 MF_IC5.30
RE0  (via drill 0.33)
  Top 0.406: MF_IC5.8 69.45,13.76 86.47,13.76 89.11,13.76 96.43,21.07 96.43,23.71 96.43,24.12 94.39,26.25 94.39,27.98 v93.78,28.59
  Bottom 0.406: v93.78,28.59 91.6,30.77 91.6,53.38 J8.3
RE1  (via drill 0.33)
  Top 0.406: MF_IC5.9 71.18,12.94 86.47,12.94 89.52,12.94 99.07,22.49 99.07,27.37 99.07,32.65 v103.94,37.53
  Bottom 0.406: v103.94,37.53 106.79,40.38 106.79,53.33 J9.3
RE2  (via drill 0.33)
  Top 0.406: MF_IC5.10 72.91,12.13 86.47,12.13 89.92,12.13 98.25,20.46 100.08,20.46 100.9,21.27 100.9,28.79 100.9,31.64 v106.79,37.53 | 123.3,54.65 J10.3 123.3,54.65 | v109.23,48.71 113.9,53.38 122.03,53.38 123.3,54.65
  Bottom 0.406: v106.79,37.53 109.23,39.97 v109.23,48.71
TS1
  Top 0.406: J3.4 16.67,51.04 24.29,43.42 24.29,34.08 24.29,24.73 26.73,22.29 28.15,20.87 29.78,20.87 31.15,22.24 MF_R12-15.5
  Bottom 0.406: MF_R12-15.5 38.06,15.38 96.22,15.38 106.59,15.38 109.63,12.33 119.69,12.33 120.96,11.06 MF_IC6.11
TS2  (via drill 0.33)
  Top 0.406: MF_R12-15.4 33.69,24.27 31.2,26.76 v31.2,27.37
  Bottom 0.406: v31.2,27.37 31.2,47.69 31.91,48.2 J4.4 | MF_R12-15.4 39.78,16.19 96.22,16.19 107.4,16.19 108.72,14.87 119.74,14.87 121.01,13.6 MF_IC6.12
TS3  (via drill 0.33)
  Top 0.406: MF_R12-15.3 36.23,25.49 v37.9,27.17
  Bottom 0.406: v37.9,27.17 47.15,36.41 J5.4 | MF_IC6.13 119.9,17.36 107.91,17.36 107.55,17.01 42.17,17.01 41.51,17.01 MF_R12-15.3
TS4  (via drill 0.33)
  Top 0.406: MF_R12-15.2 38.77,24.78 v41.16,27.17 | v49.69,49.72 50.71,50.74 61.07,50.74 62.39,52.06 J6.4
  Bottom 0.406: v41.16,27.17 49.69,35.5 v49.69,49.72 | MF_IC6.14 121.17,18.68 119.9,19.95 109.13,19.95 106.99,17.82 86.67,17.82 43.59,17.82 43.24,17.82 MF_R12-15.2
TS5  (via drill 0.33)
  Top 0.406: MF_R16-19.5 110.29,18.63 106.89,22.04 v106.89,22.29 | v95.51,22.29 95.51,23.61 93.58,25.54 93.58,27.37 v92.46,28.49
  Bottom 0.406: v106.89,22.29 v95.51,22.29 | v92.46,28.49 89.82,31.13 84.69,31.13 77.63,38.19 J7.4 | MF_IC6.3 MF_R16-19.5
TS6  (via drill 0.33)
  Top 0.406: MF_R16-19.4 105.98,20.51 v105.98,24.37 | v97.59,24.37 95.21,26.76 v95.21,28.79
  Bottom 0.406: v105.98,24.37 104.76,24.37 v97.59,24.37 | v95.21,28.79 92.87,31.13 J8.4 | MF_IC6.4 MF_R16-19.4
TS7  (via drill 0.33)
  Top 0.406: MF_R16-19.3 105.06,18.89 105.06,20.16 v105.06,20.66 | v99.73,21.38 99.88,21.53 99.88,22.09 99.88,32.04 v105.37,37.53
  Bottom 0.406: v105.06,20.66 102.52,20.66 101.1,20.66 100.39,21.38 v99.73,21.38 | MF_IC6.5 MF_R16-19.3 | v105.37,37.53 108.11,40.27 J9.4
TS8  (via drill 0.33)
  Top 0.406: MF_IC6.6 118.37,15.94 v118.37,24.12
  Bottom 0.406: J10.4 121.62,50.38 121.62,47.08 121.62,27.37 v118.37,24.12 | MF_IC6.6 MF_R16-19.2

### Text on the board
tNames: 5V | 5V | 5V | 5V | 12V | 5V | Vm | Vm | Vm | Vm | MI | MO | LD | CLK | GND | 5V | I4 | I3 | 12V | I5 | I2 | I6 | I1 | I7 | I0 | QH# | SER | GND | QH
bNames: Fader 1 | 5V | W | M11 | Fader 2 | 5V | W | M21 | Fader 3 | 5V | W | M31 | Fader 4 | 5V | W | M41 | Fader 5 | 5V | W | M51 | Fader 6 | 5V | W | M61 | Fader 7 | 5V | W | M71 | Fader 8 | 5V | W | M81 | GND | T0 | M12 | GND | T1 | M22 | GND | T2 | M32 | GND | T3 | M42 | GND | T4 | M52 | GND | T5 | M62 | GND | T6 | M72 | GND | T7 | M82 | 5V | 5V | 5V | 5V | 12V | 5V | Vm | Vm | Vm | Vm | GND | MI | MO | T0 | T1 | T2 | T3 | LD | 5V | GND | CLK | GND | 5V | T4 | I4 | I3 | 12V | I5 | I2 | T5 | T6 | I6 | I1 | I7 | I0 | RX+ | TX+ | RX+ | TX+ | QH# | SER | GND | GND | RX- | TX- | GND | QH | RX- | TX-